# Altium schematic sheet jetson-nano.SchDoc
size A3; SheetNumber: 2; SheetTotal: 8
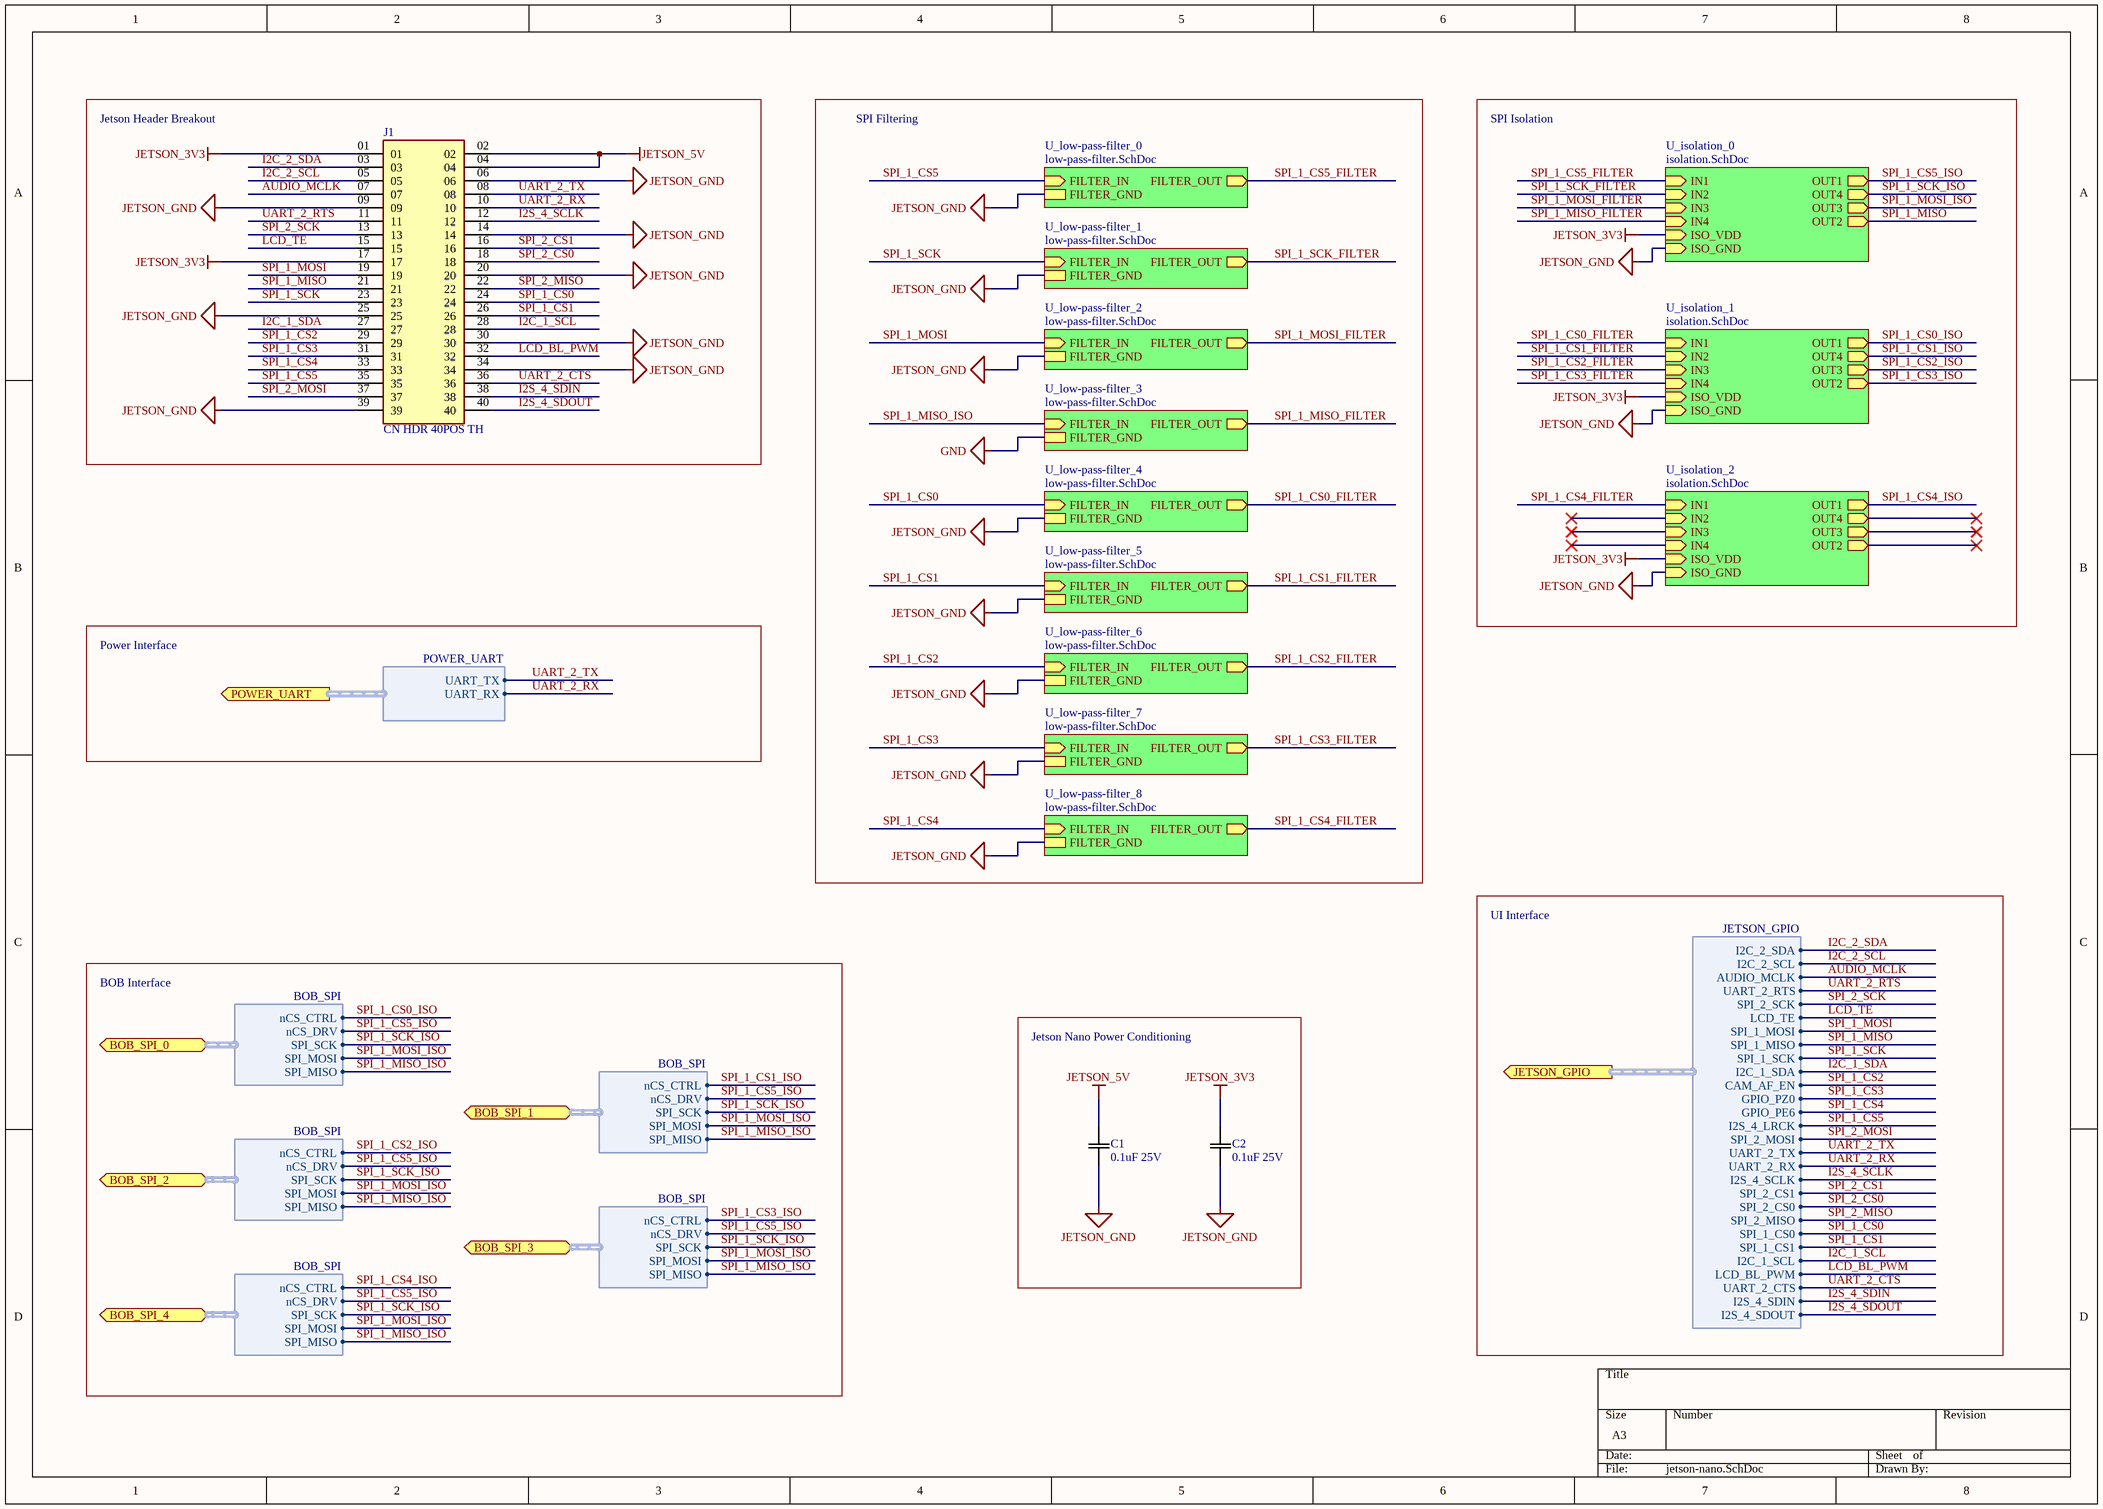
[diagram p0: jetson-nano.SchDoc]

## Parts
C1  0.1uF 25V  [0805]
C2  0.1uF 25V  [0805]
J1  CN HDR 40POS TH  [SAMTEC_SSQ-120-22-G-D]

## Blocks framed on the sheet
Jetson Header Breakout: J1
Jetson Nano Power Conditioning: C1 C2

## Sub-sheets
U_isolation_0 = isolation.SchDoc: OUT1 (out), IN1 (in), IN2 (in), IN3 (in), OUT4 (out), OUT3 (out), OUT2 (out), IN4 (in), ISO_VDD (in), ISO_GND (in)
U_isolation_1 = isolation.SchDoc: OUT1 (out), IN1 (in), IN2 (in), IN3 (in), OUT4 (out), OUT3 (out), OUT2 (out), IN4 (in), ISO_VDD (in), ISO_GND (in)
U_isolation_2 = isolation.SchDoc: OUT1 (out), IN1 (in), IN2 (in), IN3 (in), OUT4 (out), OUT3 (out), OUT2 (out), IN4 (in), ISO_VDD (in), ISO_GND (in)
U_low-pass-filter_0 = low-pass-filter.SchDoc: FILTER_OUT (out), FILTER_IN (in), FILTER_GND
U_low-pass-filter_1 = low-pass-filter.SchDoc: FILTER_OUT (out), FILTER_IN (in), FILTER_GND
U_low-pass-filter_2 = low-pass-filter.SchDoc: FILTER_OUT (out), FILTER_IN (in), FILTER_GND
U_low-pass-filter_3 = low-pass-filter.SchDoc: FILTER_OUT (out), FILTER_IN (in), FILTER_GND
U_low-pass-filter_4 = low-pass-filter.SchDoc: FILTER_OUT (out), FILTER_IN (in), FILTER_GND
U_low-pass-filter_5 = low-pass-filter.SchDoc: FILTER_OUT (out), FILTER_IN (in), FILTER_GND
U_low-pass-filter_6 = low-pass-filter.SchDoc: FILTER_OUT (out), FILTER_IN (in), FILTER_GND
U_low-pass-filter_7 = low-pass-filter.SchDoc: FILTER_OUT (out), FILTER_IN (in), FILTER_GND
U_low-pass-filter_8 = low-pass-filter.SchDoc: FILTER_OUT (out), FILTER_IN (in), FILTER_GND

## Ports
BOB_SPI_0 (bidir, harness BOB_SPI), BOB_SPI_1 (bidir, harness BOB_SPI), BOB_SPI_2 (bidir, harness BOB_SPI), BOB_SPI_3 (bidir, harness BOB_SPI), BOB_SPI_4 (bidir, harness BOB_SPI), JETSON_GPIO (out, harness JETSON_GPIO), POWER_UART (out, harness POWER_UART)

## Harnesses
BOB_SPI: nCS_CTRL, nCS_DRV, SPI_SCK, SPI_MOSI, SPI_MISO
POWER_UART: UART_TX, UART_RX
JETSON_GPIO: I2C_2_SDA, I2C_2_SCL, AUDIO_MCLK, UART_2_RTS, SPI_2_SCK, LCD_TE, SPI_1_MOSI, SPI_1_MISO, SPI_1_SCK, I2C_1_SDA, CAM_AF_EN, GPIO_PZ0, GPIO_PE6, I2S_4_LRCK, SPI_2_MOSI, UART_2_TX, UART_2_RX, I2S_4_SCLK, SPI_2_CS1, SPI_2_CS0, SPI_2_MISO, SPI_1_CS0, SPI_1_CS1, I2C_1_SCL, LCD_BL_PWM, UART_2_CTS, I2S_4_SDIN, I2S_4_SDOUT

## Nets
GND: sheet U_low-pass-filter_3/FILTER_GND
JETSON_3V3: C2.1(C1) J1.01 J1.17 ; sheet U_isolation_0/ISO_VDD, sheet U_isolation_1/ISO_VDD, sheet U_isolation_2/ISO_VDD
JETSON_5V: C1.1(C1) J1.02 J1.04
JETSON_GND: C1.2(C2) C2.2(C2) J1.06 J1.09 J1.14 J1.20 J1.25 J1.30 J1.34 J1.39 ; sheet U_isolation_0/ISO_GND, sheet U_isolation_1/ISO_GND, sheet U_isolation_2/ISO_GND, sheet U_low-pass-filter_0/FILTER_GND, sheet U_low-pass-filter_1/FILTER_GND, sheet U_low-pass-filter_2/FILTER_GND, sheet U_low-pass-filter_4/FILTER_GND, sheet U_low-pass-filter_5/FILTER_GND, sheet U_low-pass-filter_6/FILTER_GND, sheet U_low-pass-filter_7/FILTER_GND, sheet U_low-pass-filter_8/FILTER_GND
AUDIO_MCLK: J1.07 ; port JETSON_GPIO.AUDIO_MCLK
I2C_1_SCL: J1.28 ; port JETSON_GPIO.I2C_1_SCL
I2C_1_SDA: J1.27 ; port JETSON_GPIO.I2C_1_SDA
I2C_2_SCL: J1.05 ; port JETSON_GPIO.I2C_2_SCL
I2C_2_SDA: J1.03 ; port JETSON_GPIO.I2C_2_SDA
I2S_4_SCLK: J1.12 ; port JETSON_GPIO.I2S_4_SCLK
I2S_4_SDIN: J1.38 ; port JETSON_GPIO.I2S_4_SDIN
I2S_4_SDOUT: J1.40 ; port JETSON_GPIO.I2S_4_SDOUT
LCD_BL_PWM: J1.32 ; port JETSON_GPIO.LCD_BL_PWM
LCD_TE: J1.15 ; port JETSON_GPIO.LCD_TE
SPI_1_CS0: J1.24 ; sheet U_low-pass-filter_4/FILTER_IN, port JETSON_GPIO.SPI_1_CS0
SPI_1_CS0_FILTER: sheet U_isolation_1/IN1, sheet U_low-pass-filter_4/FILTER_OUT
SPI_1_CS0_ISO: sheet U_isolation_1/OUT1, port BOB_SPI_0.nCS_CTRL
SPI_1_CS1: J1.26 ; sheet U_low-pass-filter_5/FILTER_IN, port JETSON_GPIO.SPI_1_CS1
SPI_1_CS1_FILTER: sheet U_isolation_1/IN2, sheet U_low-pass-filter_5/FILTER_OUT
SPI_1_CS1_ISO: sheet U_isolation_1/OUT4, port BOB_SPI_1.nCS_CTRL
SPI_1_CS2: J1.29 ; sheet U_low-pass-filter_6/FILTER_IN, port JETSON_GPIO.CAM_AF_EN
SPI_1_CS2_FILTER: sheet U_isolation_1/IN3, sheet U_low-pass-filter_6/FILTER_OUT
SPI_1_CS2_ISO: sheet U_isolation_1/OUT3, port BOB_SPI_2.nCS_CTRL
SPI_1_CS3: J1.31 ; sheet U_low-pass-filter_7/FILTER_IN, port JETSON_GPIO.GPIO_PZ0
SPI_1_CS3_FILTER: sheet U_isolation_1/IN4, sheet U_low-pass-filter_7/FILTER_OUT
SPI_1_CS3_ISO: sheet U_isolation_1/OUT2, port BOB_SPI_3.nCS_CTRL
SPI_1_CS4: J1.33 ; sheet U_low-pass-filter_8/FILTER_IN, port JETSON_GPIO.GPIO_PE6
SPI_1_CS4_FILTER: sheet U_isolation_2/IN1, sheet U_low-pass-filter_8/FILTER_OUT
SPI_1_CS4_ISO: sheet U_isolation_2/OUT1, port BOB_SPI_4.nCS_CTRL
SPI_1_CS5: J1.35 ; sheet U_low-pass-filter_0/FILTER_IN, port JETSON_GPIO.I2S_4_LRCK
SPI_1_CS5_FILTER: sheet U_isolation_0/IN1, sheet U_low-pass-filter_0/FILTER_OUT
SPI_1_CS5_ISO: sheet U_isolation_0/OUT1, port BOB_SPI_0.nCS_DRV, port BOB_SPI_2.nCS_DRV, port BOB_SPI_1.nCS_DRV, port BOB_SPI_3.nCS_DRV, port BOB_SPI_4.nCS_DRV
SPI_1_MISO: J1.21 ; sheet U_isolation_0/OUT2, port JETSON_GPIO.SPI_1_MISO
SPI_1_MISO_FILTER: sheet U_isolation_0/IN4, sheet U_low-pass-filter_3/FILTER_OUT
SPI_1_MISO_ISO: sheet U_low-pass-filter_3/FILTER_IN, port BOB_SPI_0.SPI_MISO, port BOB_SPI_2.SPI_MISO, port BOB_SPI_1.SPI_MISO, port BOB_SPI_3.SPI_MISO, port BOB_SPI_4.SPI_MISO
SPI_1_MOSI: J1.19 ; sheet U_low-pass-filter_2/FILTER_IN, port JETSON_GPIO.SPI_1_MOSI
SPI_1_MOSI_FILTER: sheet U_isolation_0/IN3, sheet U_low-pass-filter_2/FILTER_OUT
SPI_1_MOSI_ISO: sheet U_isolation_0/OUT3, port BOB_SPI_0.SPI_MOSI, port BOB_SPI_2.SPI_MOSI, port BOB_SPI_1.SPI_MOSI, port BOB_SPI_3.SPI_MOSI, port BOB_SPI_4.SPI_MOSI
SPI_1_SCK: J1.23 ; sheet U_low-pass-filter_1/FILTER_IN, port JETSON_GPIO.SPI_1_SCK
SPI_1_SCK_FILTER: sheet U_isolation_0/IN2, sheet U_low-pass-filter_1/FILTER_OUT
SPI_1_SCK_ISO: sheet U_isolation_0/OUT4, port BOB_SPI_0.SPI_SCK, port BOB_SPI_2.SPI_SCK, port BOB_SPI_1.SPI_SCK, port BOB_SPI_3.SPI_SCK, port BOB_SPI_4.SPI_SCK
SPI_2_CS0: J1.18 ; port JETSON_GPIO.SPI_2_CS0
SPI_2_CS1: J1.16 ; port JETSON_GPIO.SPI_2_CS1
SPI_2_MISO: J1.22 ; port JETSON_GPIO.SPI_2_MISO
SPI_2_MOSI: J1.37 ; port JETSON_GPIO.SPI_2_MOSI
SPI_2_SCK: J1.13 ; port JETSON_GPIO.SPI_2_SCK
UART_2_CTS: J1.36 ; port JETSON_GPIO.UART_2_CTS
UART_2_RTS: J1.11 ; port JETSON_GPIO.UART_2_RTS
UART_2_RX: J1.10 ; port POWER_UART.UART_RX, port JETSON_GPIO.UART_2_RX
UART_2_TX: J1.08 ; port POWER_UART.UART_TX, port JETSON_GPIO.UART_2_TX

## Notes on the sheet
- SPI Filtering
- SPI Isolation
- Power Interface
- UI Interface
- BOB Interface

## Library data of the parts
C1 C2 = CAP 0.1uF 25V: CAP CER 0.1UF 25V X7R 0805/0603; Tolerance: 10%; Value: 0.1uF; Temperature Coefficient: X7R; Rating: 25V; Operating Temperature: -55°C ~ 125°C
J1 = CN HDR 40POS TH: SSQ - Samtec 2.54mm Square Tail Dual Row Socket Strip 8.5mm Profile; MP: SSQ-120-22-G-D; Value: *; Price: None; Package: None; MF: Samtec; Check_prices: https://www.snapeda.com/parts/SSQ-120-22-G-D/Samtec/view-part/3393219/?ref=eda; Availability: In Stock; SnapEDA_Link: https://www.snapeda.com/parts/SSQ-120-22-G-D/Samtec/view-part/3393219/?ref=snap; Purchase-URL: https://pricing.snapeda.com/search/part/SSQ-120-22-G-D/?ref=eda; Digikey: S6104-ND